# Altium schematic sheet TSystemTimers.schDoc: LiveDesign Evaluation - Video Windows
size A4; Organization: Altium Limited; Address1: L3, 12a Rodborough Rd; Address2: Frenchs Forest; Address3: NSW; Address4: Australia 2086; DocumentNumber: 15; SheetNumber: 15; SheetTotal: 20
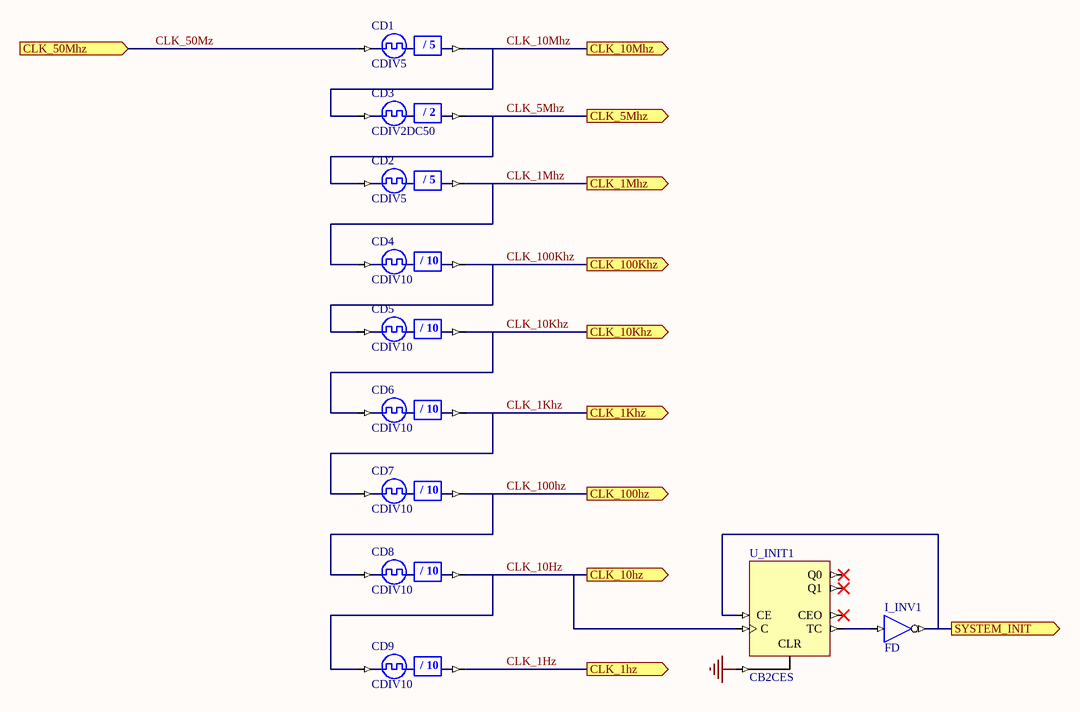
[diagram p0: TSystemTimers.schDoc]

## Parts
CD1  CDIV5
CD2  CDIV5
CD3  CDIV2DC50
CD4  CDIV10
CD5  CDIV10
CD6  CDIV10
CD7  CDIV10
CD8  CDIV10
CD9  CDIV10
I_INV1  FD
U_INIT1  CB2CES

## Ports
CLK_1hz (out), CLK_1Khz (out), CLK_1Mhz (out), CLK_5Mhz (out), CLK_10hz (out), CLK_10Khz (out), CLK_10Mhz (out), CLK_50Mhz (in), CLK_100hz (out), CLK_100Khz (out), SYSTEM_INIT (out)

## Nets
GND: U_INIT1.CLR
CLK_1Hz: CD9.CLKDV ; port CLK_1hz
CLK_1Khz: CD6.CLKDV CD7.CLKIN ; port CLK_1Khz
CLK_1Mhz: CD2.CLKDV CD4.CLKIN ; port CLK_1Mhz
CLK_5Mhz: CD2.CLKIN CD3.CLKDV ; port CLK_5Mhz
CLK_10Hz: CD8.CLKDV CD9.CLKIN U_INIT1.C ; port CLK_10hz
CLK_10Khz: CD5.CLKDV CD6.CLKIN ; port CLK_10Khz
CLK_10Mhz: CD1.CLKDV CD3.CLKIN ; port CLK_10Mhz
CLK_50Mz: CD1.CLKIN ; port CLK_50Mhz
CLK_100hz: CD7.CLKDV CD8.CLKIN ; port CLK_100hz
CLK_100Khz: CD4.CLKDV CD5.CLKIN ; port CLK_100Khz
SYSTEM_INIT: I_INV1.O U_INIT1.CE ; port SYSTEM_INIT
NetI_INV1_I: I_INV1.I U_INIT1.TC

Not connected (* = marked no-connect by the designer): U_INIT1 CEO* Q0* Q1*

## Notes on the sheet
- Title
- Size:
- Date:
- A4
- Number:
- Time:
- Revision:
- Sheet
- of
- File:
- (in symbol CDIV2DC50) / 2
- (in symbol CDIV5) / 5
- (in symbol CDIV10) / 10

## Library data of the parts
CD1 CD2 = CDIV5: Clock Divider by 5; ArchiveName: GENERIC; Published: 9-30-2003; Publisher: Altium Limited; Core Revision: 1.00.00
CD3 = CDIV2DC50: Clock Divider by 2 with 50% Duty Cycle Output; Xilinx Equivalent: CLK_DIV2; ArchiveName: GENERIC; VHDLIB_SIM: GENERIC_LIB; Published: 29-Jan-2004; Publisher: Altium Limited; Core Revision: 1.00.00
CD4-CD9 = CDIV10: Clock Divider by 10; Xilinx Equivalent: CLK_DIV10; ArchiveName: GENERIC; Published: 9-30-2003; Publisher: Altium Limited; Core Revision: 1.00.00
I_INV1 = INV: Inverter; ArchiveName: GENERIC; Published: 9-30-2003; Publisher: Altium Limited; Xilinx Equivalent: INV; Core Revision: 1.00.00
U_INIT1 = CB2CES: 2-Bit Cascadable Binary Counters with Clock Enable and Asynchronous Clear, Single Pin Version; Xilinx Equivalent: CB2CE; ArchiveName: GENERIC; Published: 9-30-2003; Publisher: Altium Limited; Core Revision: 1.00.00